# Altium schematic sheet DPPXHK_10CL010_FPGA.SchDoc
size A4
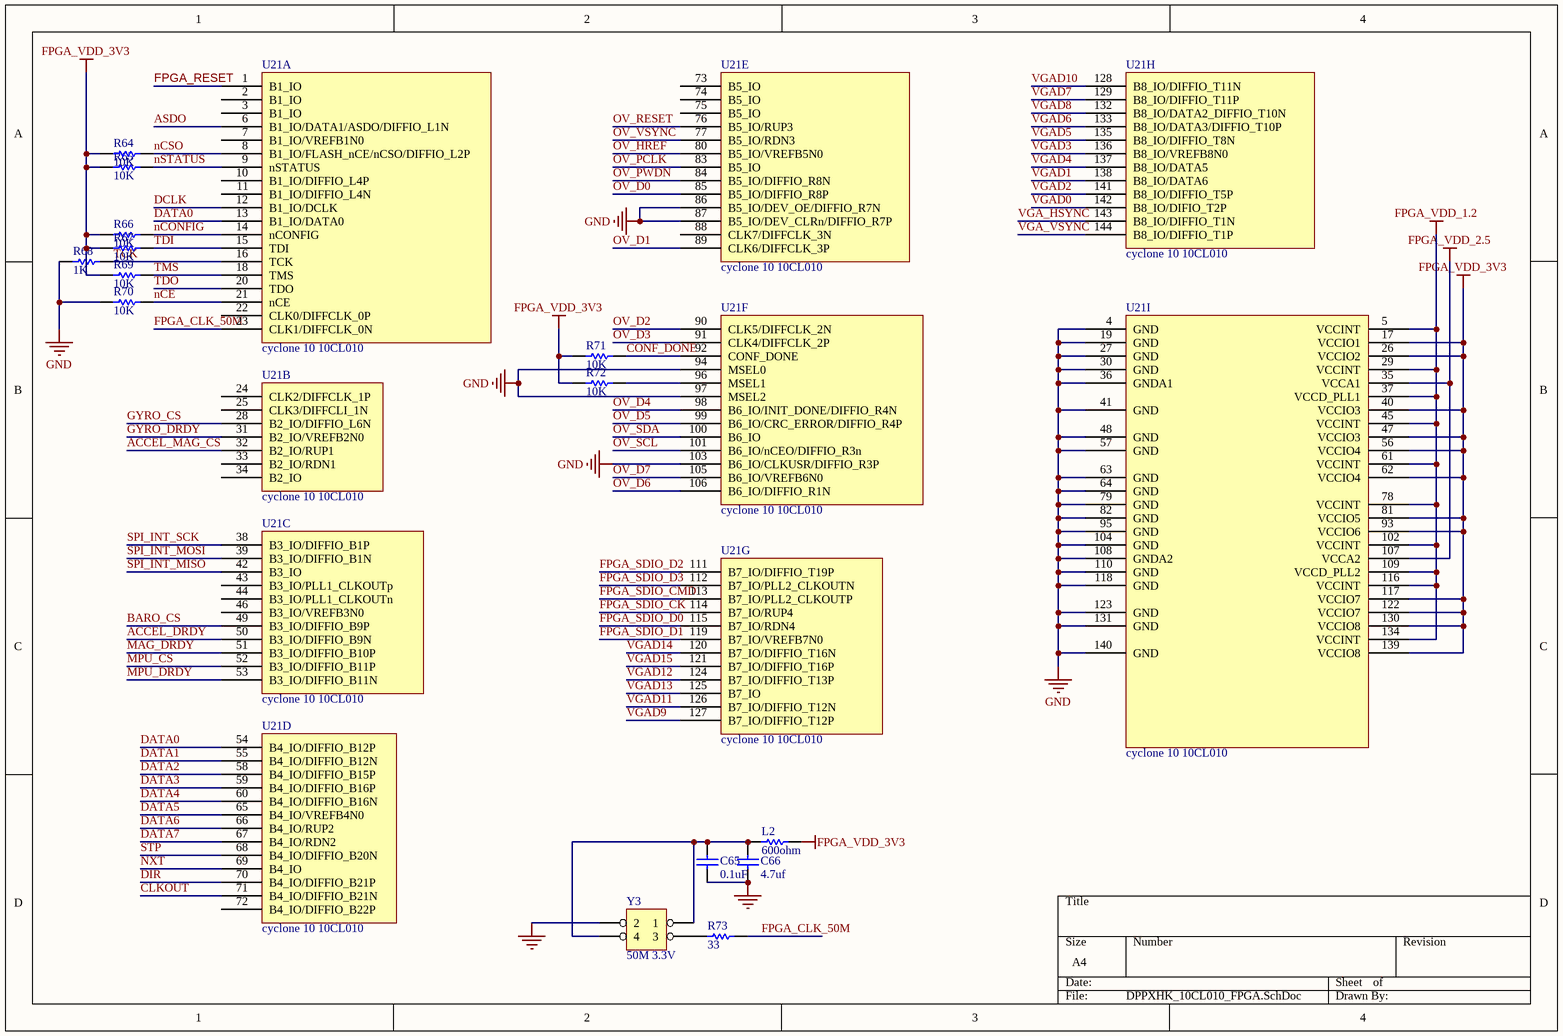
[diagram p0: DPPXHK_10CL010_FPGA.SchDoc]

## Parts
C65  value 0.1uF  [LC0402]  (hidden comment: 104)
C66  value 4.7uf  [LC0402]  (hidden comment: 105)
L2  value 600ohm  [0402R]  (hidden comment: 10K)
R64  10K  [0402R]
R65  10K  [0402R]
R66  10K  [0402R]
R67  10K  [0402R]
R68  value 1K  [0402R]  (hidden comment: 10K)
R69  10K  [0402R]
R70  10K  [0402R]
R71  10K  [0402R]
R72  10K  [0402R]
R73  value 33  [0402R]  (hidden comment: 10K)
U21  cyclone 10 10CL010  (parts A,B,C,D,E,F,G,H,I of 9)
Y3  50M 3.3V  [OSCILLATOR-3.2X2.5]

## Nets
FPGA_VDD_1.2: U21.5(VCCINT) U21.29(VCCINT) U21.37(VCCD_PLL1) U21.45(VCCINT) U21.61(VCCINT) U21.78(VCCINT) U21.102(VCCINT) U21.109(VCCD_PLL2) U21.116(VCCINT) U21.134(VCCINT)
FPGA_VDD_2.5: U21.35(VCCA1) U21.107(VCCA2)
FPGA_VDD_3V3: L2.2 R64.1 R65.1 R66.1 R67.1 R69.1 R71.1 R72.1 U21.17(VCCIO1) U21.26(VCCIO2) U21.40(VCCIO3) U21.47(VCCIO3) U21.56(VCCIO4) U21.62(VCCIO4) U21.81(VCCIO5) U21.93(VCCIO6) U21.117(VCCIO7) U21.122(VCCIO7) U21.130(VCCIO8) U21.139(VCCIO8)
GND: C65.1 C66.1 R68.1 R70.1 U21.4(GND) U21.19(GND) U21.27(GND) U21.30(GND) U21.36(GNDA1) U21.41(GND) U21.48(GND) U21.57(GND) U21.63(GND) U21.64(GND) U21.79(GND) U21.82(GND) U21.86(B5_IO/DEV_OE/DIFFIO_R7N) U21.87(B5_IO/DEV_CLRn/DIFFIO_R7P) U21.94(MSEL0) U21.95(GND) U21.97(MSEL2) U21.103(B6_IO/CLKUSR/DIFFIO_R3P) U21.104(GND) U21.108(GNDA2) U21.110(GND) U21.118(GND) U21.123(GND) U21.131(GND) U21.140(GND) Y3.2
ACCEL_DRDY: U21.50(B3_IO/DIFFIO_B9N)
ACCEL_MAG_CS: U21.32(B2_IO/RUP1)
ASDO: U21.6(B1_IO/DATA1/ASDO/DIFFIO_L1N)
BARO_CS: U21.49(B3_IO/DIFFIO_B9P)
CLKOUT: U21.71(B4_IO/DIFFIO_B21N)
CONF_DONE: R71.2 U21.92(CONF_DONE)
DATA0: U21.13(B1_IO/DATA0) U21.54(B4_IO/DIFFIO_B12P)
DATA1: U21.55(B4_IO/DIFFIO_B12N)
DATA2: U21.58(B4_IO/DIFFIO_B15P)
DATA3: U21.59(B4_IO/DIFFIO_B16P)
DATA4: U21.60(B4_IO/DIFFIO_B16N)
DATA5: U21.65(B4_IO/VREFB4N0)
DATA6: U21.66(B4_IO/RUP2)
DATA7: U21.67(B4_IO/RDN2)
DCLK: U21.12(B1_IO/DCLK)
DIR: U21.70(B4_IO/DIFFIO_B21P)
FPGA_CLK_50M: R73.2 U21.23(CLK1/DIFFCLK_0N)
FPGA_RESET: U21.1(B1_IO)
FPGA_SDIO_CK: U21.114(B7_IO/RUP4)
FPGA_SDIO_CMD: U21.113(B7_IO/PLL2_CLKOUTP)
FPGA_SDIO_D0: U21.115(B7_IO/RDN4)
FPGA_SDIO_D1: U21.119(B7_IO/VREFB7N0)
FPGA_SDIO_D2: U21.111(B7_IO/DIFFIO_T19P)
FPGA_SDIO_D3: U21.112(B7_IO/PLL2_CLKOUTN)
GYRO_CS: U21.28(B2_IO/DIFFIO_L6N)
GYRO_DRDY: U21.31(B2_IO/VREFB2N0)
MAG_DRDY: U21.51(B3_IO/DIFFIO_B10P)
MPU_CS: U21.52(B3_IO/DIFFIO_B11P)
MPU_DRDY: U21.53(B3_IO/DIFFIO_B11N)
nCE: R70.2 U21.21(nCE)
nCONFIG: R66.2 U21.14(nCONFIG)
nCSO: R64.2 U21.8(B1_IO/FLASH_nCE/nCSO/DIFFIO_L2P)
nSTATUS: R65.2 U21.9(nSTATUS)
NXT: U21.69(B4_IO)
OV_D0: U21.85(B5_IO/DIFFIO_R8P)
OV_D1: U21.89(CLK6/DIFFCLK_3P)
OV_D2: U21.90(CLK5/DIFFCLK_2N)
OV_D3: U21.91(CLK4/DIFFCLK_2P)
OV_D4: U21.98(B6_IO/INIT_DONE/DIFFIO_R4N)
OV_D5: U21.99(B6_IO/CRC_ERROR/DIFFIO_R4P)
OV_D6: U21.106(B6_IO/DIFFIO_R1N)
OV_D7: U21.105(B6_IO/VREFB6N0)
OV_HREF: U21.80(B5_IO/VREFB5N0)
OV_PCLK: U21.83(B5_IO)
OV_PWDN: U21.84(B5_IO/DIFFIO_R8N)
OV_RESET: U21.76(B5_IO/RUP3)
OV_SCL: U21.101(B6_IO/nCEO/DIFFIO_R3n)
OV_SDA: U21.100(B6_IO)
OV_VSYNC: U21.77(B5_IO/RDN3)
SPI_INT_MISO: U21.42(B3_IO)
SPI_INT_MOSI: U21.39(B3_IO/DIFFIO_B1N)
SPI_INT_SCK: U21.38(B3_IO/DIFFIO_B1P)
STP: U21.68(B4_IO/DIFFIO_B20N)
TCK: R68.2 U21.16(TCK)
TDI: R67.2 U21.15(TDI)
TDO: U21.20(TDO)
TMS: R69.2 U21.18(TMS)
VGA_HSYNC: U21.143(B8_IO/DIFFIO_T1N)
VGA_VSYNC: U21.144(B8_IO/DIFFIO_T1P)
VGAD0: U21.142(B8_IO/DIFIO_T2P)
VGAD1: U21.138(B8_IO/DATA6)
VGAD2: U21.141(B8_IO/DIFFIO_T5P)
VGAD3: U21.136(B8_IO/VREFB8N0)
VGAD4: U21.137(B8_IO/DATA5)
VGAD5: U21.135(B8_IO/DIFFIO_T8N)
VGAD6: U21.133(B8_IO/DATA3/DIFFIO_T10P)
VGAD7: U21.129(B8_IO/DIFFIO_T11P)
VGAD8: U21.132(B8_IO/DATA2_DIFFIO_T10N)
VGAD9: U21.127(B7_IO/DIFFIO_T12P)
VGAD10: U21.128(B8_IO/DIFFIO_T11N)
VGAD11: U21.126(B7_IO/DIFFIO_T12N)
VGAD12: U21.124(B7_IO/DIFFIO_T13P)
VGAD13: U21.125(B7_IO)
VGAD14: U21.120(B7_IO/DIFFIO_T16N)
VGAD15: U21.121(B7_IO/DIFFIO_T16P)
NetC65_2: C65.2 C66.2 L2.1 Y3.1 Y3.4
NetR72_2: R72.2 U21.96(MSEL1)
NetR73_1: R73.1 Y3.3

Not connected (* = marked no-connect by the designer): U21 2(B1_IO) 3(B1_IO) 7(B1_IO/VREFB1N0) 10(B1_IO/DIFFIO_L4P) 11(B1_IO/DIFFIO_L4N) 22(CLK0/DIFFCLK_0P) 24(CLK2/DIFFCLK_1P) 25(CLK3/DIFFCLI_1N) 33(B2_IO/RDN1) 34(B2_IO) 43(B3_IO/PLL1_CLKOUTp) 44(B3_IO/PLL1_CLKOUTn) 46(B3_IO/VREFB3N0) 72(B4_IO/DIFFIO_B22P) 73(B5_IO) 74(B5_IO) 75(B5_IO) 88(CLK7/DIFFCLK_3N)

## Library data of the parts
C65 C66 = Cap Semi: Capacitor (Semiconductor SIM Model); Published: 8-Jun-2000; Revision: July-2002: Re-released for DXP Platform.; Publisher: Altium Limited
L2 R64-R73 = Res1: Resistor; Manufacturer: Generic Components; Class: Passive; Published: 08/06/2000; Publisher: Altium Hobart Technology Centre; SubClass: Resistor
  R64-R67 R69-R72: Value: 10K
U21 = 10CL010E144
Y3 = HEADER 2X2